# EAGLE design shades_v30 (EAGLE 9.6.2)
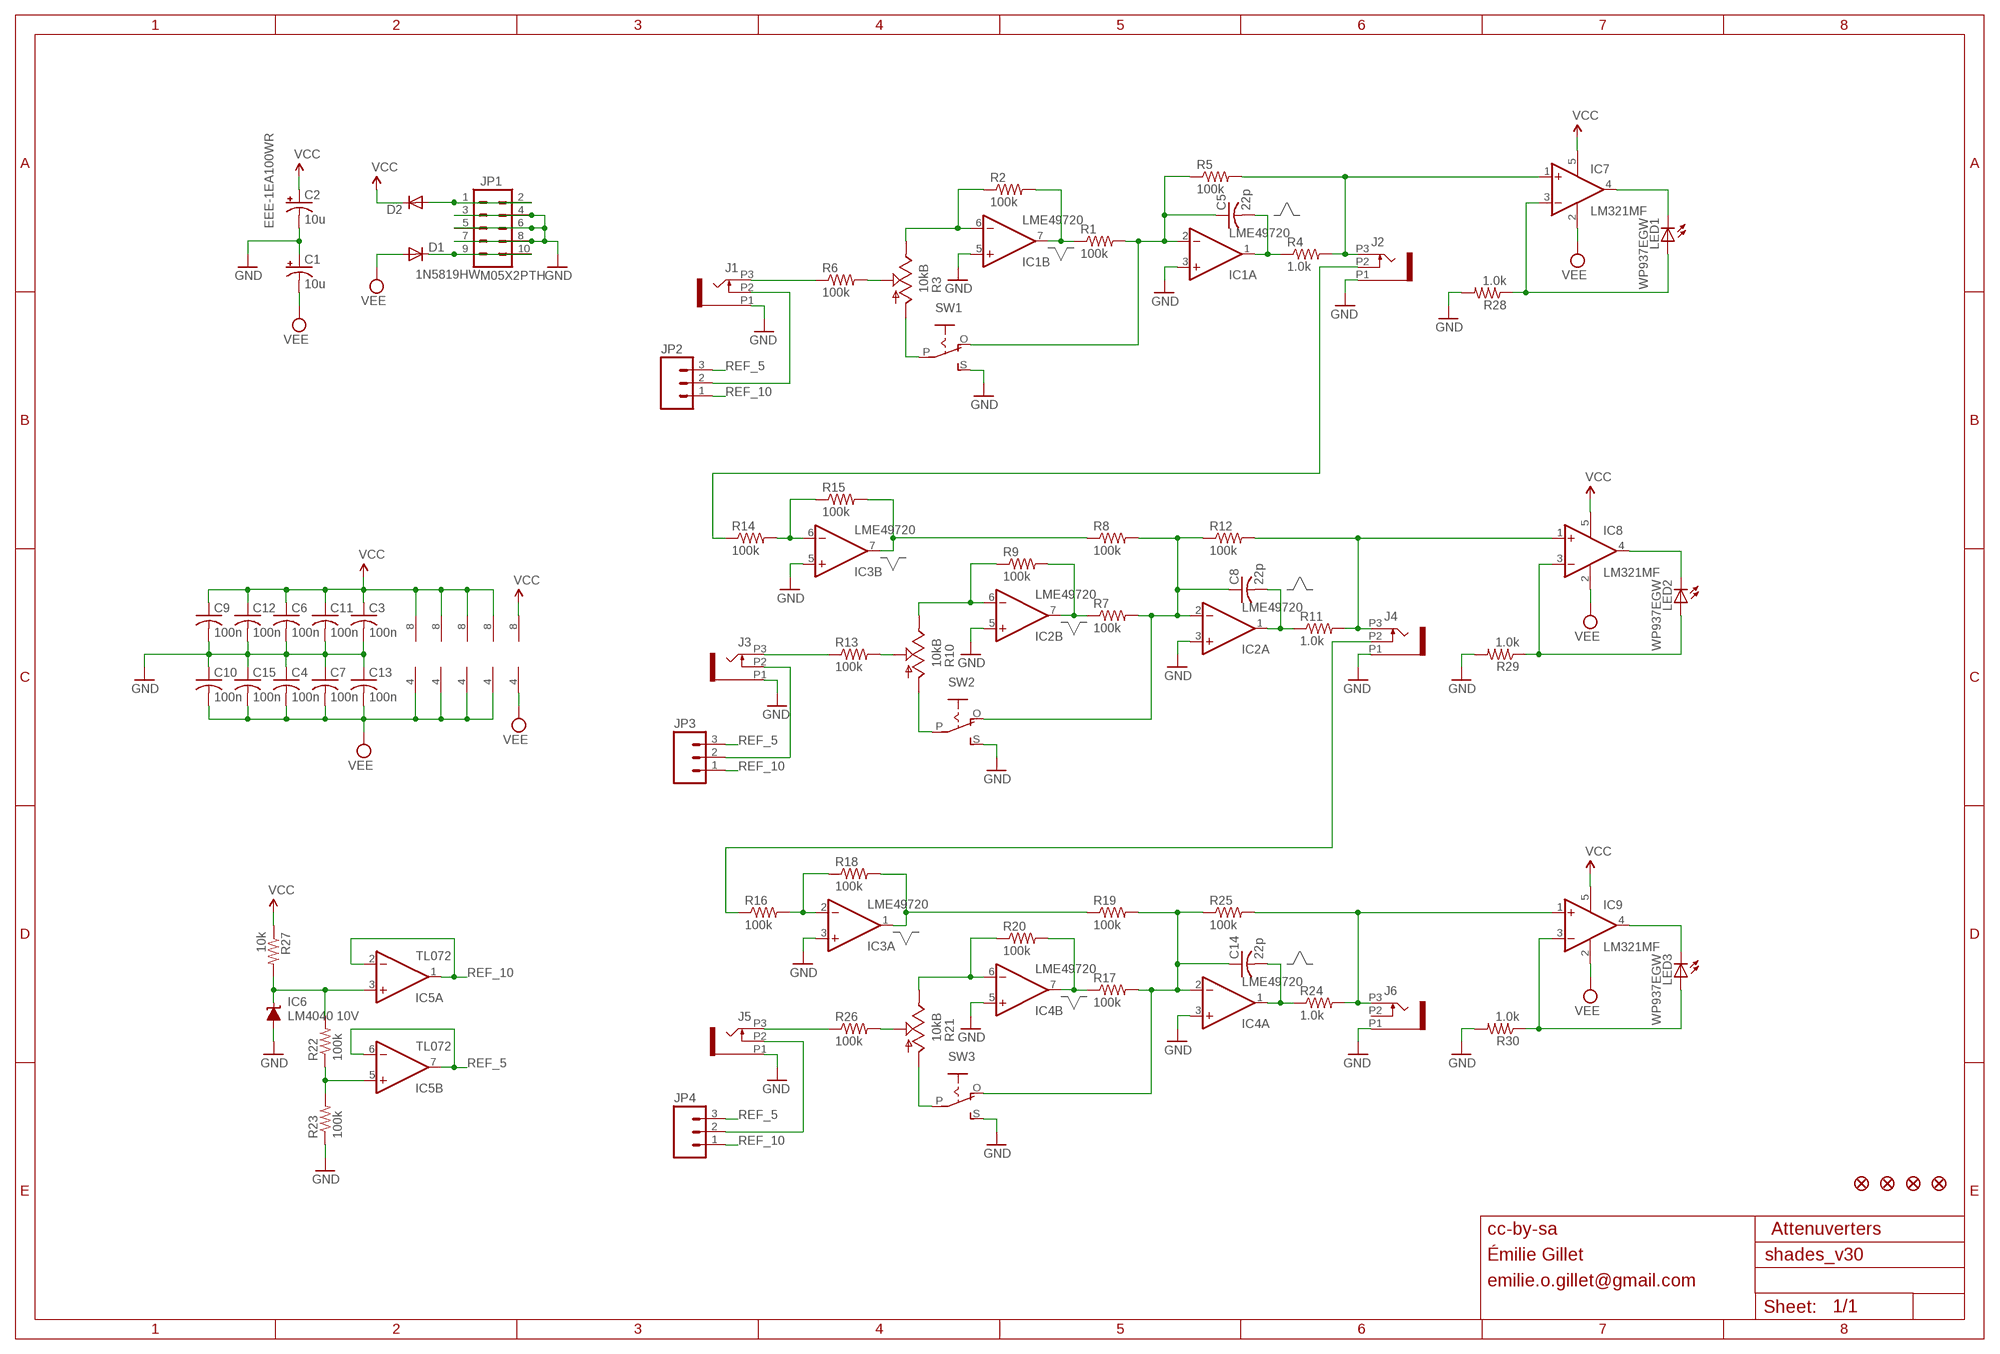
[diagram p0: schematic, sheet 1]

## Parts
C1  10u  CPOL-USB  [PANASONIC_B]
C2  10u  CPOL-USB  [PANASONIC_B]
C3  100n  C-USC0603  [C0603]
C4  100n  C-USC0603  [C0603]
C5  22p  C-USC0603  [C0603]
C6  100n  C-USC0603  [C0603]
C7  100n  C-USC0603  [C0603]
C8  22p  C-USC0603  [C0603]
C9  100n  C-USC0603  [C0603]
C10  100n  C-USC0603  [C0603]
C11  100n  C-USC0603  [C0603]
C12  100n  C-USC0603  [C0603]
C13  100n  C-USC0603  [C0603]
C14  22p  C-USC0603  [C0603]
C15  100n  C-USC0603  [C0603]
D1  1N5819HW  DIODE-SOD123  [SOD123]
D2  1N5819HW  DIODE-SOD123  [SOD123]
F1  FIDUCIAL1X2  [FIDUCIAL-1X2]
F2  FIDUCIAL1X2  [FIDUCIAL-1X2]
F3  FIDUCIAL1X2  [FIDUCIAL-1X2]
F4  FIDUCIAL1X2  [FIDUCIAL-1X2]
IC1  LME49720  TL072D  [SO08]
IC2  LME49720  TL072D  [SO08]
IC3  LME49720  TL072D  [SO08]
IC4  LME49720  TL072D  [SO08]
IC5  TL072  TL072D  [SO08]
IC6  LM4040 10V  LM4041C12DBZ  [DBZ_R-PDSO-G3]
IC7  LM321MF  [SOT23-5]
IC8  LM321MF  [SOT23-5]
IC9  LM321MF  [SOT23-5]
J1  PJ301_THONKICONN6  [WQP_PJ_301M6]
J2  PJ301_THONKICONN6  [WQP_PJ_301M6]
J3  PJ301_THONKICONN6  [WQP_PJ_301M6]
J4  PJ301_THONKICONN6  [WQP_PJ_301M6]
J5  PJ301_THONKICONN6  [WQP_PJ_301M6]
J6  PJ301_THONKICONN6  [WQP_PJ_301M6]
JP1  M05X2PTH  [AVR_ICSP]
JP2  M03PTH  [1X03]
JP3  M03PTH  [1X03]
JP4  M03PTH  [1X03]
LED1  WP937EGW  LED3MM  [LED3MM]
LED2  WP937EGW  LED3MM  [LED3MM]
LED3  WP937EGW  LED3MM  [LED3MM]
R1  100k  R-US_R0603  [R0603]
R2  100k  R-US_R0603  [R0603]
R3  10kB  POT_USVERTICAL_PS  [ALPS_POT_VERTICAL_PS]
R4  1.0k  R-US_R0603  [R0603]
R5  100k  R-US_R0603  [R0603]
R6  100k  R-US_R0603  [R0603]
R7  100k  R-US_R0603  [R0603]
R8  100k  R-US_R0603  [R0603]
R9  100k  R-US_R0603  [R0603]
R10  10kB  POT_USVERTICAL_PS  [ALPS_POT_VERTICAL_PS]
R11  1.0k  R-US_R0603  [R0603]
R12  100k  R-US_R0603  [R0603]
R13  100k  R-US_R0603  [R0603]
R14  100k  R-US_R0603  [R0603]
R15  100k  R-US_R0603  [R0603]
R16  100k  R-US_R0603  [R0603]
R17  100k  R-US_R0603  [R0603]
R18  100k  R-US_R0603  [R0603]
R19  100k  R-US_R0603  [R0603]
R20  100k  R-US_R0603  [R0603]
R21  10kB  POT_USVERTICAL_PS  [ALPS_POT_VERTICAL_PS]
R22  100k  R-US_R0603  [R0603]
R23  100k  R-US_R0603  [R0603]
R24  1.0k  R-US_R0603  [R0603]
R25  100k  R-US_R0603  [R0603]
R26  100k  R-US_R0603  [R0603]
R27  10k  R-US_R0603  [R0603]
R28  1.0k  R-US_R0603  [R0603]
R29  1.0k  R-US_R0603  [R0603]
R30  1.0k  R-US_R0603  [R0603]
SW1  S-ON-ONSMALL_SLIDE  [ES_100SP1T6B11M2QEH_SMALL]
SW2  S-ON-ONSMALL_SLIDE  [ES_100SP1T6B11M2QEH_SMALL]
SW3  S-ON-ONSMALL_SLIDE  [ES_100SP1T6B11M2QEH_SMALL]

## Nets
GND: C1.+ C2.- C3.2 C4.1 C6.2 C7.1 C9.2 C10.1 C11.2 C12.2 C13.1 C15.1 IC1.3(A:+IN) IC1.5(B:+IN) IC2.3(A:+IN) IC2.5(B:+IN) IC3.3(A:+IN) IC3.5(B:+IN) IC4.3(A:+IN) IC4.5(B:+IN) IC6.2(A) J1.P1 J2.P1 J3.P1 J4.P1 J5.P1 J6.P1 JP1.3 JP1.4 JP1.5 JP1.6 JP1.7 JP1.8 R23.1 R28.2 R29.2 R30.2 SW1.S SW2.S SW3.S
N$1: J1.P2 JP2.2
N$2: J3.P2 JP3.2
N$3: J5.P2 JP4.2
N$4: IC7.3(-IN) LED1.A R28.1
N$5: IC5.5(B:+IN) R22.1 R23.2
N$6: D2.A JP1.1 JP1.2
N$7: IC7.4(OUT) LED1.K(C)
N$9: J1.P3 R6.1
N$10: R3.P$2(S) R6.2
N$11: R3.P$3(A) SW1.P
N$12: C5.1 IC1.2(A:-IN) R1.2 R5.1 SW1.O
N$13: IC1.6(B:-IN) R2.1 R3.P$1(E)
N$14: IC1.7(B:OUT) R1.1 R2.2
N$15: C5.2 IC1.1(A:OUT) R4.1
N$16: J3.P3 R13.1
N$17: IC8.3(-IN) LED2.A R29.1
N$18: R10.P$2(S) R13.2
N$19: R10.P$3(A) SW2.P
N$20: D1.C JP1.9 JP1.10
N$22: IC2.6(B:-IN) R9.1 R10.P$1(E)
N$23: IC2.7(B:OUT) R7.1 R9.2
N$24: IC8.4(OUT) LED2.K(C)
N$25: C8.2 IC2.1(A:OUT) R11.1
N$26: J5.P3 R26.1
N$27: R21.P$2(S) R26.2
N$30: IC4.6(B:-IN) R20.1 R21.P$1(E)
N$31: IC4.7(B:OUT) R17.1 R20.2
N$33: C14.2 IC4.1(A:OUT) R24.1
N$34: IC9.3(-IN) LED3.A R30.1
N$35: IC9.4(OUT) LED3.K(C)
N$36: IC3.6(B:-IN) R14.2 R15.1
N$37: IC3.2(A:-IN) R16.2 R18.1
N$38: IC3.1(A:OUT) R18.2 R19.1
N$39: IC3.7(B:OUT) R8.1 R15.2
N$40: C14.1 IC4.2(A:-IN) R17.2 R19.2 R25.1 SW3.O
N$41: C8.1 IC2.2(A:-IN) R7.2 R8.2 R12.1 SW2.O
OUT_1: IC7.1(+IN) J2.P3 R4.2 R5.2
OUT_2: IC8.1(+IN) J4.P3 R11.2 R12.2
OUT_3: IC9.1(+IN) J6.P3 R24.2 R25.2
REF_5: IC5.6(B:-IN) IC5.7(B:OUT) JP2.3 JP3.3 JP4.3
REF_10: IC5.1(A:OUT) IC5.2(A:-IN) JP2.1 JP3.1 JP4.1
REF_10_UNBUF: IC5.3(A:+IN) IC6.1(C) R22.2 R27.2
SEND_1: J2.P2 R14.1
SEND_2: J4.P2 R16.1
SW3: R21.P$3(A) SW3.P
VCC: C2.+ C3.1 C6.1 C9.1 C11.1 C12.1 D2.C IC1.8(P:V+) IC2.8(P:V+) IC3.8(P:V+) IC4.8(P:V+) IC5.8(P:V+) IC7.5(V+) IC8.5(V+) IC9.5(V+) R27.1
VEE: C1.- C4.2 C7.2 C10.2 C13.2 C15.2 D1.A IC1.4(P:V-) IC2.4(P:V-) IC3.4(P:V-) IC4.4(P:V-) IC5.4(P:V-) IC7.2(V-) IC8.2(V-) IC9.2(V-)
Unconnected: J6.P2

## Notes on the sheet
- EEE-1EA100WR
- cc-by-sa | Attenuverters
- Émilie Gillet
- emilie.o.gillet@gmail.com

## Library data of the parts
C1 C2 = rcl:CPOL-US: POLARIZED CAPACITOR, American symbol
C3-C15 = rcl:C-US: CAPACITOR, American symbol
D1 D2 = diode:DIODE-: DIODE
F1-F4 = SparkFun:FIDUCIAL: Fiducial Alignment Points Various fiducial points for machine vision alignment.
IC1-IC5 = gm-ics:TL072: OP AMP
IC6 = texas:LM4041: PRECISION MICROPOWER SHUNT VOLTAGE REFERENCE Source: http://focus.ti.com/lit/ds/slcs146e/slcs146e.pdf
IC7-IC9 = linear:LM321?*: Low Power Single Op Amp Source: http://cache.national.com/ds/LM/LM321.pdf
J1-J6 = og-pj301:PJ301_THONKICONN
JP1 = og-header:M05X2: Header 5x2 Standard 10-pin dual row 0.1" header. Commonly used with AVR-ISP. Use with Spark Fun Electronics SKU: PRT-00778
JP2-JP4 = SparkFun:M03: Header 3 Standard 3-pin 0.1" header. Use with straight break away headers (SKU : PRT-00116), right angle break away headers (PRT-00553), swiss pins (PRT-00743), machine pins (PRT-00117), and female headers (PRT-00115). Molex polarized connector foot print use with SKU : PRT-08232 with associated crimp pins and housings.
LED1-LED3 = led:LED: LED OSRAM: - CHIPLED LG R971, LG N971, LY N971, LG Q971, LY Q971, LO R971, LY R971 LH N974, LH R974 LS Q976, LO Q976, LY Q976 LO Q996 - Hyper CHIPLED LW Q18S LB Q993, LB Q99A, LB R99A - SideLED LS A670, LO A670, LY A670, LG A670, LP A670 LB A673, LV A673, LT A673, LW A673 LH A674 LY A675 LS A676, LA A676, LO A676, LY A676, LW A676 LS A679, LY A679, LG A679 - Hyper Micro SIDELED® LS Y876, LA Y876, LO Y876, LY Y876 LT Y87S - SmartLED LW L88C, LW L88S LB L89C, LB L89S, LG L890 LS L89K, LO L89K, LY L89K LS L896, LA L896, LO L896, LY L896 - TOPLED LS T670, LO T670, LY T670, LG T670, LP T670 LSG T670, LSP T670, LSY T670, LOP T670, LYG T670 LG T671, LOG T671, LSG T671 LB T673, LV T673, LT T673, LW T673 LH T674 LS T676, LA T676, LO T676, LY T676, LB T676, LH T676, LSB T676, LW T676 LB T67C, LV T67C, LT T67C, LS T67K, LO T67K, LY T67K, LW E67C LS E67B, LA E67B, LO E67B, LY E67B, LB E67C, LV E67C, LT E67C LW T67C LS T679, LY T679, LG T679 LS T770, LO T770, LY T770, LG T770, LP T770 LB T773, LV T773, LT T773, LW T773 LH T774 LS E675, LA E675, LY E675, LS T675 LS T776, LA T776, LO T776, LY T776, LB T776 LHGB T686 LT T68C, LB T68C - Hyper Mini TOPLED® LB M676 - Mini TOPLED Santana® LG M470 LS M47K, LO M47K, LY M47K Source: http://www.osram.convergy.de LUXEON: - LUMILED® LXK2-PW12-R00, LXK2-PW12-S00, LXK2-PW14-U00, LXK2-PW14-V00 LXK2-PM12-R00, LXK2-PM12-S00, LXK2-PM14-U00 LXK2-PE12-Q00, LXK2-PE12-R00, LXK2-PE12-S00, LXK2-PE14-T00, LXK2-PE14-U00 LXK2-PB12-K00, LXK2-PB12-L00, LXK2-PB12-M00, LXK2-PB14-N00, LXK2-PB14-P00, LXK2-PB14-Q00 LXK2-PR12-L00, LXK2-PR12-M00, LXK2-PR14-Q00, LXK2-PR14-R00 LXK2-PD12-Q00, LXK2-PD12-R00, LXK2-PD12-S00 LXK2-PH12-R00, LXK2-PH12-S00 LXK2-PL12-P00, LXK2-PL12-Q00, LXK2-PL12-R00 Source: www.luxeon.com KINGBRIGHT: KA-3528ASYC Source: www.kingbright.com
R1 R2 R4-R9 R11-R20 R22-R26 R28-R30 = rcl:R-US_: RESISTOR, American symbol
R3 R10 R21 = pot-alps:POT_US
R27 = resistor:R-US_: RESISTOR, American symbol
SW1-SW3 = og-switch:S-ON-ON: On-on Switch

## Board
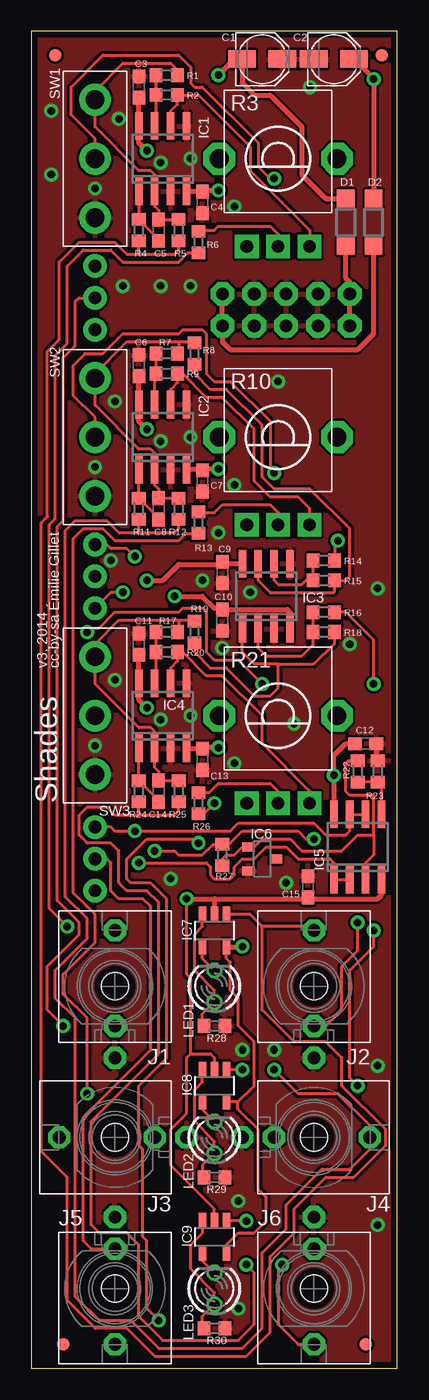
[diagram p1: board, top side]
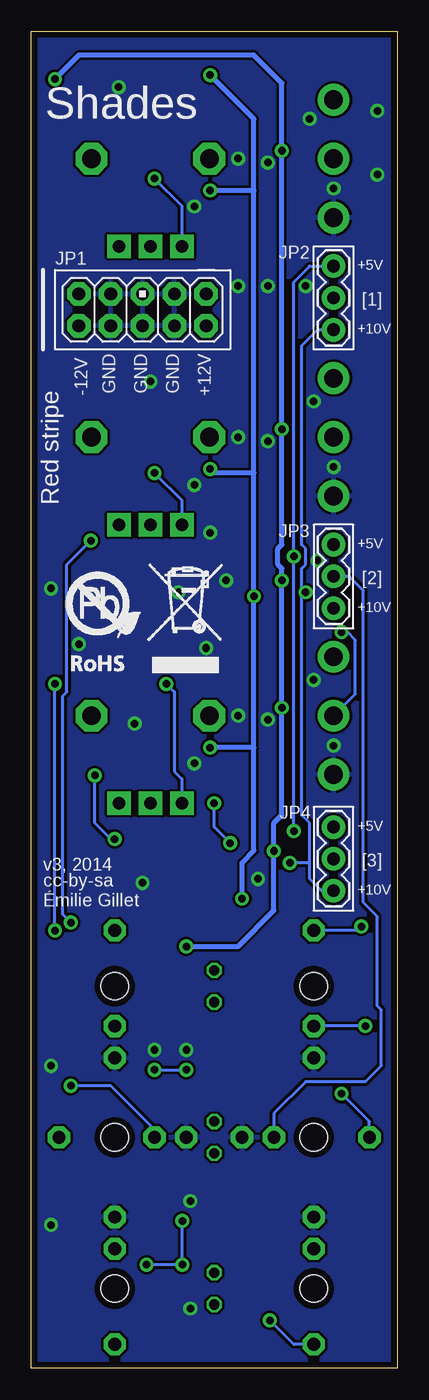
[diagram p2: board, bottom side, seen from below]

Size 29.19 x 106.68 mm. Coordinates in mm from the lower left corner, seen from the top.
Outline: 0,0 29.19,0 29.19,106.68 0,106.68 0,0
Copper layers (1*16): Top 0.035mm / dielectric 1.5mm / Bottom 0.035mm
Design rules "PCBCart-Standard": minimum track width 8mil, minimum drill 0.4mm, track to track 8mil, track to pad 8mil, pad to pad 8mil, via to via 8mil, smd to smd 8mil, copper to edge 20mil, drill to drill 8mil, minimum pad ring 8mil, minimum via ring 10mil, stop-mask expansion 3mil, vias tented up to drill 25mil, thermal gap 8mil

### Footprints (pad centres in the part's own frame; a part is rotated, then mirrored left to right if it is on the bottom)
PANASONIC_B = smd 2.2 x 1.4: + 1.6,0; - -1.6,0
C0603 = smd 1.1 x 1: 1 -0.85,0; 2 0.85,0
SOD123 = smd 1.4 x 1.4: A 1.9,0; C -1.9,0
FIDUCIAL-1X2 = smd 1 x 1: 1 0,0
SO08 = smd 0.6 x 2.2: 1 -1.905,-2.6; 2 -0.635,-2.6; 3 0.635,-2.6; 4 1.905,-2.6; 5 1.905,2.6; 6 0.635,2.6; 7 -0.635,2.6; 8 -1.905,2.6
DBZ_R-PDSO-G3 = smd 0.7 x 1: 1 -0.95,-1.1; 2 0.95,-1.1; 3 0,1.1
SOT23-5 = smd 0.6 x 1.2: 1 -0.95,-1.306; 2 0,-1.306; 3 0.95,-1.306; 4 0.95,1.306; 5 -0.95,1.306
WQP_PJ_301M6 = drill 1.016 pad 1.778 octagon: P1 0,-5.715; P2 0,-3.175; P3 0,4.445 | hole 2.2: 0,0
AVR_ICSP = drill 1.016 pad 1.88 octagon: 1 -1.27,5.08; 2 1.27,5.08; 3 -1.27,2.54; 4 1.27,2.54; 5 -1.27,0; 6 1.27,0; 7 -1.27,-2.54; 8 1.27,-2.54; 9 -1.27,-5.08; 10 1.27,-5.08
1X03 = drill 1.016 pad 1.88: 1 0,0; 2 2.54,0; 3 5.08,0
LED3MM = drill 0.813 octagon: A -1.27,0; K 1.27,0
R0603 = smd 1 x 1.1: 1 -0.85,0; 2 0.85,0
ALPS_POT_VERTICAL_PS = drill 1 pad 1.88 square: P$1 -2.5,7; P$2 0,7; P$3 2.5,7 | drill 1.5 pad 2.54 octagon: P$4 -4.7,0; P$5 4.7,0
ES_100SP1T6B11M2QEH_SMALL = drill 1.5 pad 2.54: O -4.699,0; P 0,0; S 4.699,0

### Placement (x,y rotation side)
C1  18.41,104.46 0 top
C2  24.13,104.46 0 top
C3  8.57,102.24 90 top
C4  13.65,93.03 90 top
C5  10.16,90.81 270 top
C6  8.57,80.01 90 top
C7  13.65,70.8 90 top
C8  10.16,68.58 270 top
C9  15.24,63.5 270 top
C10  15.24,59.69 90 top
C11  8.57,57.78 90 top
C12  26.67,49.85 0 top
C13  13.65,48.58 90 top
C14  10.16,46.04 270 top
C15  22.07,38.42 270 top
D1  25.08,91.44 90 top
D2  27.31,91.44 270 top
F1  1.91,104.78 90 top
F2  27.94,104.78 90 top
F3  2.54,1.91 90 top
F4  26.67,1.91 90 top
IC1  10.48,96.52 0 top
IC2  10.48,74.3 0 top
IC3  18.73,61.59 0 top
IC4  10.48,52.07 0 top
IC5  26.04,41.59 0 top
IC6  18.41,40.64 270 top
IC7  14.61,34.92 180 top
IC8  14.61,22.54 180 top
IC9  14.61,10.48 180 top
J1  6.67,30.48 0 top
J2  22.54,30.48 0 top
J3  6.67,18.41 90 top
J4  22.54,18.41 270 top
J5  6.67,6.35 180 top
J6  22.54,6.35 180 top
JP1  20.32,84.45 270 bottom
JP2  5.08,82.87 90 bottom
JP3  5.08,60.64 90 bottom
JP4  5.08,38.1 90 bottom
LED1  14.61,30.48 90 top
LED2  14.61,18.41 90 top
LED3  14.61,6.35 90 top
R1  10.79,103.19 0 top
R2  10.79,101.6 180 top
R3  19.68,96.52 180 top
R4  8.57,90.81 270 top
R5  11.75,90.81 270 top
R6  13.34,89.85 90 top
R7  10.79,80.96 0 top
R8  13.02,80.96 90 top
R9  10.79,79.38 180 top
R10  19.68,74.3 180 top
R11  8.57,68.58 270 top
R12  11.75,68.58 270 top
R13  13.33,67.47 90 top
R14  23.34,64.45 180 top
R15  23.34,62.87 0 top
R16  23.34,60.33 180 top
R17  10.79,58.74 0 top
R18  23.34,58.74 0 top
R19  13.02,58.74 90 top
R20  10.8,57.15 180 top
R21  19.68,52.07 180 top
R22  26.04,47.62 90 top
R23  27.62,47.62 270 top
R24  8.57,46.04 270 top
R25  11.75,46.04 270 top
R26  13.34,45.09 90 top
R27  15.24,40.96 270 top
R28  14.61,27.3 0 top
R29  14.61,15.24 0 top
R30  14.61,3.17 0 top
SW1  5.08,96.52 270 top
SW2  5.08,74.3 270 top
SW3  5.08,52.07 270 top
U$2  [ROHS]  27.3,54.93 0 bottom

### Tracks (layer width: path | path; a pad name or v marks a point on that pad's centre or on a via)
GND  (via drill 0.6)
  Top 0.254: 27.52,48.58 R23.1
  Top 0.406: C12.2 27.52,48.58
  other vias: 16.51,13.34 16.83,25.4 12.7,96.52 5.08,94.14 5.08,71.91 12.7,74.3 16.19,92.71 16.19,70.48 5.08,49.69 12.7,52.07 16.19,48.26 27.62,62.23 13.65,62.87 15.24,57.47 22.23,102.23 7.3,86.36 12.7,86.36 6.99,99.69 6.67,77.15 6.67,54.93 20.32,38.73 25.4,57.78 20.95,51.44 17.46,61.91 6.35,64.45 14.92,66.67 1.59,100.33 1.59,95.25 27.62,11.43 27.62,24.13 19.37,25.4 19.68,78.74 10.32,73.98 10.32,51.75 11.11,39.05 10.32,86.36 10.32,96.2 16.51,4.76
  pour Bottom: 0,106.68 0,0 29.21,0 29.21,106.68
  pour Top: 0,106.68 0,0 29.21,0 29.21,106.68
N$1  (via drill 0.6)
  Top 0.254: JP2.2 3.81,85.41 3.49,85.09 3.49,81.6 2.54,80.64 2.54,67.63 2.06,67.15 2.06,37.31 3.81,35.56 3.81,34.61 1.27,32.07 1.27,28.57 v2.54,27.3
  Bottom 0.254: v2.54,27.3 J1.P2
N$2
  Bottom 0.254: JP3.2 3.81,63.18 2.7,62.07 2.7,37.15 1.59,36.04 1.59,28.89 1.27,28.57 1.27,24.13 2.54,22.86 7.3,22.86 9.84,20.32 J3.P2
N$3
  Top 0.254: JP4.2 6.03,40.64 6.35,40.32 6.35,38.1 6.99,37.47 8.89,37.47 9.53,36.83 9.53,25.4 4.13,20 4.13,10.16 4.76,9.53 J5.P2
N$4
  Top 0.254: R28.1 13.65,27.41 13.65,28.26 LED1.A 14.61,30.16 13.02,31.75 13.02,34.61 13.65,35.24 IC7.3
N$5
  Top 0.254: R22.1 R23.2 27.62,46.67 27.94,46.35 IC5.5
N$6
  Top 0.406: D2.A | D2.A 27.3,82.55 26.04,81.28 15.88,81.28 15.24,81.92 JP1.2 JP1.1
N$7
  Top 0.254: IC7.4 13.65,32.7 LED1.K
N$9  (via drill 0.6)
  Top 0.254: v2.86,35.24 1.43,36.67 1.43,67.31 1.91,67.79 1.91,80.8 2.86,81.76 2.86,87.95 4.13,89.22 6.35,89.22 7.3,88.27 11.75,88.27 12.48,89 R6.1
  Bottom 0.254: v2.86,35.24 2.9,35.28 3.25,34.92 J1.P3
N$10
  Top 0.254: R6.2 13.44,90.81 14.61,90.81 14.92,91.12 19.05,91.12 19.68,90.49 R3.P$2
N$11  (via drill 0.6)
  Top 0.254: v19.37,94.93 19.05,94.93 18.1,95.89 18.1,97.79 13.65,102.23 13.02,102.23 12.7,102.55 12.7,103.82 11.75,104.78 5.71,104.78 3.17,102.23 3.17,100.01 5.08,98.11 SW1.P
  Bottom 0.254: v19.37,94.93 17.18,92.75 R3.P$3
N$12
  Top 0.254: R5.1 C5.1 10.16,92.39 9.84,92.71 IC1.2 9.84,95.25 9.53,95.57 8.57,95.57 5.08,99.06 SW1.O 5.08,101.92 7.3,104.14 11.11,104.14 11.64,103.61 R1.2
N$13
  Top 0.254: IC1.6 11.11,100.33 11.64,100.86 R2.1 13.34,101.6 17.46,97.47 17.46,95.57 22.23,90.81 22.23,89.56 R3.P$1
N$14
  Top 0.254: IC1.7 9.95,99.22 R2.2 | R2.2 | R2.2 R1.1
N$15
  Top 0.254: IC1.1 R4.1 10.16,90.07 C5.2
N$16  (via drill 0.6)
  Top 0.254: 4.45,36.83 3.33,37.94 3.33,66.2 4.13,66.99 5.71,66.99 6.67,66.04 11.75,66.04 12.33,66.62 R13.1 | 4.45,36.83 | 4.45,36.83 5.08,36.2 5.08,33.97 2.54,31.43 2.54,29.84 4.45,27.94 v4.45,21.91
  Bottom 0.254: v4.45,21.91 2.22,19.68 J3.P3
N$17
  Top 0.254: R29.1 13.65,15.34 13.65,16.19 LED2.A 14.61,18.1 13.02,19.68 13.02,22.23 13.65,22.86 IC8.3
N$18
  Top 0.254: R13.2 13.39,68.26 14.61,68.26 15.24,68.9 19.05,68.9 19.68,68.26 R10.P$2
N$19  (via drill 0.6)
  Top 0.254: v19.37,71.44 19.05,71.75 19.05,75.56 15.88,78.74 14.61,78.74 13.97,79.38 13.97,82.55 13.65,82.87 12.06,82.87 11.75,82.55 7.3,82.55 5.71,80.96 4.29,80.96 3.33,80.01 3.33,77.63 5.08,75.88 SW2.P
  Bottom 0.254: v19.37,71.44 17.18,69.25 R10.P$3
N$20
  Top 0.406: JP1.10 JP1.9 25.4,86.68 25.08,87 D1.C
N$22
  Top 0.254: R10.P$1 22.23,67.33 22.23,68.58 21.27,69.53 19.05,69.53 17.78,70.8 17.78,74.93 15.24,77.47 13.97,77.47 12.06,79.38 R9.1 11.64,78.64 11.11,78.11 IC2.6
N$23
  Top 0.254: IC2.7 9.84,78.74 9.95,78.84 R9.2 R7.1
N$24
  Top 0.254: IC8.4 13.65,20.64 LED2.K
N$25
  Top 0.254: IC2.1 R11.1 10.16,67.84 C8.2
N$26  (via drill 0.6)
  Top 0.254: v13.34,41.91 13.02,42.23 9.21,42.23 7.62,40.64 7.62,39.05 7.94,38.73 9.53,38.73 10.79,37.47 10.79,24.77 8.57,22.54 8.57,17.78 8.89,17.46 8.89,10.48 9.21,10.16 9.21,4.76 v10.16,3.81 | v14.61,45.09 13.76,44.23 R26.1
  Bottom 0.254: v13.34,41.91 14.61,43.18 v14.61,45.09 | v10.16,3.81 8.26,1.91 J5.P3
N$27
  Top 0.254: R21.P$2 19.68,46.04 19.05,46.67 14.92,46.67 14.19,45.94 R26.2
N$30
  Top 0.254: IC4.6 | IC4.6 11.11,55.88 11.64,56.41 R20.1 12.06,57.15 13.97,55.24 15.24,55.24 18.41,52.07 18.41,49.85 22.23,46.04 22.23,45.11 R21.P$1
N$31
  Top 0.254: IC4.7 9.95,54.77 R20.2 | R20.2 | R20.2 R17.1
N$33
  Top 0.254: IC4.1 R24.1 10.16,45.3 C14.2
N$34
  Top 0.254: R30.1 13.65,3.28 13.65,4.13 LED3.A 14.61,6.03 12.7,7.94 12.7,9.84 13.65,10.8 IC9.3
N$35
  Top 0.254: IC9.4 13.65,8.57 LED3.K
N$36
  Top 0.254: IC3.6 19.37,62.87 19.68,62.55 21.59,62.55 21.91,62.87 R15.1 R14.2
N$37
  Top 0.254: IC3.2 18.1,57.47 18.73,56.83 21.59,56.83 22.49,57.73 R18.1 R16.2
N$38
  Top 0.254: R19.1 13.02,57.15 14.29,55.88 15.56,55.88 17.78,53.66 19.05,53.66 19.68,54.29 19.68,56.2 | IC3.1 16.83,57.15 17.78,56.2 19.68,56.2 | 19.68,56.2 22.54,56.2 24.19,57.84 R18.2
N$39
  Top 0.254: R8.1 13.02,79.38 14.29,78.11 15.56,78.11 18.41,75.25 18.41,71.12 19.37,70.17 22.23,70.17 25.4,66.99 25.4,63.18 25.08,62.87 R15.2 24.19,61.97 24.13,61.91 19.05,61.91 18.1,62.87 IC3.7
N$40
  Top 0.254: C14.1 | C14.1 10.16,47.62 9.84,47.94 IC4.2 9.84,50.8 | C14.1 R25.1 | R19.2 12.91,59.69 11.75,59.69 | 11.75,59.69 6.99,59.69 5.08,57.78 SW3.O 5.08,54.61 8.57,51.12 9.53,51.12 9.84,50.8 | R17.2 11.75,58.84 11.75,59.69 | 9.84,50.8
N$41
  Top 0.254: R12.1 C8.1 10.16,70.17 9.84,70.48 IC2.2 9.84,73.03 9.53,73.34 8.57,73.34 5.08,76.83 SW2.O 5.08,79.38 7.62,81.92 11.75,81.92 | R7.2 11.75,81.06 11.75,81.92 | R8.2 12.91,81.92 11.75,81.92
OUT_1
  Top 0.254: IC7.1 15.59,36.2 17.46,36.2 18.38,35.28 18.41,35.28 | R5.2 11.75,89.22 11.43,88.9 8.57,88.9 | 8.57,88.9 7.62,88.9 6.67,89.85 3.81,89.85 2.22,88.27 2.22,82.07 1.27,81.12 1.27,67.94 0.79,67.47 0.79,17.3 2.86,15.24 2.86,5.4 5.08,3.17 7.62,3.17 9.84,0.95 17.14,0.95 19.05,2.86 19.05,8.89 20.95,10.79 20.95,12.7 23.5,15.24 25.72,15.24 28.26,17.78 28.26,19.05 24.77,22.54 24.77,24.77 23.5,26.04 20.95,26.04 18.41,28.57 18.41,35.28 | 8.57,88.9 R4.2 | J2.P3 22.19,35.28 18.41,35.28
OUT_2  (via drill 0.6)
  Top 0.254: IC8.1 15.59,23.81 v16.83,23.81 | R12.2 11.75,66.99 11.43,66.67 8.57,66.67 | 8.57,66.67 6.99,66.67 6.03,67.63 3.49,67.63 2.7,66.83 2.7,37.62 4.45,35.88 4.45,34.29 1.91,31.75 1.91,29.53 3.49,27.94 3.49,5.71 5.4,3.81 7.94,3.81 10.16,1.59 16.83,1.59 18.41,3.17 18.41,9.21 20.32,11.11 20.32,13.02 23.18,15.88 25.4,15.88 26.99,17.46 J4.P3 26.99,19.37 24.45,21.91 21.27,21.91 v19.37,23.81 | 8.57,66.67 R11.2
  Bottom 0.254: v19.37,23.81 v16.83,23.81
OUT_3  (via drill 0.6)
  Top 0.254: IC9.1 15.59,11.75 v17.14,11.75 | R25.2 11.75,44.45 11.43,44.13 8.57,44.13 | 8.57,44.13 6.67,44.13 6.03,44.77 4.45,44.77 3.81,44.13 3.81,42.55 4.45,41.91 6.35,41.91 6.99,41.27 6.99,38.73 7.62,38.1 9.21,38.1 10.16,37.15 10.16,25.08 4.76,19.68 4.76,11.43 5.4,10.79 7.62,10.79 8.57,9.84 8.57,4.13 10.48,2.22 16.51,2.22 17.78,3.49 17.78,7.62 v17.14,8.26 | R24.2 8.57,44.13 | v20,8.26 19.68,7.94 19.68,3.49 21.27,1.91 J6.P3
  Bottom 0.254: v17.14,11.75 v17.14,8.26 v20,8.26
REF_5  (via drill 0.6)
  Top 0.254: JP3.3 6.03,65.72 6.35,65.41 7.62,65.41 v8.26,64.77 | JP4.3 6.35,43.18 6.67,42.86 v8.26,42.86 15.88,42.86 16.51,43.5 22.54,43.5 23.5,42.55 25.08,42.55 25.4,42.86 IC5.7 IC5.6
  Bottom 0.254: JP2.3 6.99,87.95 8.26,86.68 v8.26,64.77 v8.26,42.86
REF_10  (via drill 0.6)
  Top 0.254: IC5.2 IC5.1 24.13,40.32 23.81,40.64 21.27,40.64 20.32,41.59 18.73,41.59 17.78,40.64 16.83,40.64 16.19,40.01 16.19,39.37 15.88,39.05 14.61,39.05 14.29,39.37 14.29,40.01 13.97,40.32 v8.57,40.32 | JP3.1 6.35,61.91 v7.3,61.91
  Bottom 0.254: JP2.1 6.35,82.87 7.62,81.6 7.62,65.72 7.3,65.41 7.3,64.14 7.62,63.82 7.62,61.91 | 6.99,40.32 6.99,43.5 7.62,44.13 7.62,61.91 | 6.99,40.32 v8.57,40.32 | 6.99,40.32 6.99,39.05 6.03,38.1 JP4.1 | 7.62,61.91 v7.3,61.91
REF_10_UNBUF
  Top 0.254: IC5.3 26.67,40.32 27.3,40.96 27.3,42.55 | 27.3,42.55 27.3,45.72 25.4,45.72 25.08,46.04 25.08,48.26 25.3,48.48 R22.2 | 27.3,42.55 26.04,42.55 24.77,41.27 21.59,41.27 20.64,42.23 18.41,42.23 17.78,41.59 IC6.1 16.82,41.59 16.19,40.96 15.56,40.96 15.24,40.64 R27.2
SEND_1  (via drill 0.6)
  Top 0.254: 24.13,64.51 R14.1 24.19,65.78 v24.45,66.04 | v26.04,35.56 26.04,33.34 24.77,32.07 24.77,28.57 23.5,27.3 J2.P2
  Bottom 0.254: v24.45,66.04 26.35,64.14 26.35,53.98 26.67,53.66 26.67,36.2 v26.04,35.56
SEND_2  (via drill 0.6)
  Top 0.254: v27.3,34.92 27.3,33.66 25.4,31.75 25.4,23.18 v26.04,22.54 | R16.1 25.08,60.33 27.3,58.1 v27.3,54.61
  Bottom 0.254: v27.3,34.92 v27.3,54.61 | v26.04,22.54 22.86,22.54 19.37,19.05 J4.P2
SW3  (via drill 0.6)
  Top 0.254: v4.45,58.74 4.76,59.05 5.4,59.05 6.67,60.33 11.75,60.33 12.06,60.64 13.65,60.64 13.97,60.33 13.97,57.15 14.61,56.52 16.51,56.52 v18.41,54.61
  Bottom 0.254: v4.45,58.74 3.97,58.74 3.33,58.1 3.33,53.82 SW3.P | R21.P$3 17.18,47.03 17.78,47.62 17.78,53.98 v18.41,54.61
VCC  (via drill 0.6)
  Top 0.254: IC7.5 15.56,32.7 15.88,32.38 15.88,30.16 16.51,29.53 16.51,27.3 17.78,26.04 17.78,22.54 16.47,21.24 | 16.47,21.24 IC8.5 | IC9.5 15.59,9.21 15.56,9.24 15.56,9.84 16.51,10.79 17.78,10.79 18.73,11.75 18.73,13.65 18.1,14.29 18.1,19.05 16.47,20.67 16.47,21.24 | 15.14,64.45 C9.1 | v22.54,42.23 21.91,42.23 21.27,42.86 16.83,42.86 15.88,41.91 15.34,41.91 R27.1 14.5,41.81 13.65,40.96 11.75,40.96 11.43,41.27 v9.84,41.27
  Top 0.406: D2.C | C6.1 IC2.8 8.57,75.56 v9.21,74.93 | v9.21,97.16 8.57,97.79 IC1.8 C3.1 | C11.1 IC4.8 8.57,53.34 v9.21,52.7 | C9.1 15.39,64.19 IC3.8 | 15.14,64.45 14.82,64.14 11.75,64.14 10.48,62.87 v9.21,62.87 | IC5.8 v24.13,47.31 24.13,48.9 25.08,49.85 C12.1 | v16.83,33.66 16.79,33.62 IC7.5 | D2.C v27.3,102.87 27.3,102.88 C2.+
  Bottom 0.254: v22.54,42.23 22.86,42.23 24.13,43.5 v24.13,47.31
  Bottom 0.406: v27.3,102.87 25.4,104.78 11.43,104.78 9.21,102.55 v9.21,97.16 v9.21,74.93 9.21,65.72 9.53,65.41 9.53,64.14 9.21,63.82 v9.21,62.87 v9.21,52.7 9.21,44.13 9.84,43.5 v9.84,41.27 9.84,36.51 12.7,33.66 v16.83,33.66
VEE  (via drill 0.6)
  Top 0.254: IC9.2 14.61,12.7 11.11,16.19 11.11,19.05 12.38,20.32 12.38,24.77 12.7,25.08 | 12.7,25.08 14.29,25.08 14.61,24.77 IC8.2 | v12.38,37.47 12.38,31.43 12.7,31.11 12.7,25.08 | 15.14,60.64 C10.2
  Top 0.406: 25.08,93.66 D1.A 23.5,93.34 21.59,95.25 21.59,99.06 19.05,101.6 17.78,101.6 16.82,102.56 C1.- 16.19,104.46 v14.92,103.19 | IC1.4 12.43,93.88 C4.2 13.76,93.98 v14.92,93.98 | v14.92,71.75 13.76,71.75 C7.2 13.61,71.69 IC2.4 | 12.34,49.43 IC4.4 12.43,49.43 C13.2 13.76,49.53 v14.92,49.53 | 15.14,60.64 14.61,60.64 13.65,61.59 v11.43,61.59 | IC3.4 20.64,60.33 20.42,60.54 C10.2 | IC5.4 27.94,37.78 27.62,37.47 22.23,37.47 22.12,37.57 C15.2 21.96,37.47 14.61,37.47 | v12.38,37.47 14.61,37.47 | 14.61,37.47 IC7.2
  Bottom 0.406: v14.92,93.98 11.43,93.98 | v14.92,71.75 14.61,71.44 11.43,71.44 | 11.43,71.44 11.43,93.98 | 11.43,49.53 v11.43,61.59 11.43,71.44 | 11.43,49.53 v14.92,49.53 | v14.92,103.19 11.43,99.69 11.43,93.98 | v12.38,37.47 12.38,40.32 11.43,41.27 11.43,49.53

### Text on the board
bPlace: +5V | [1] | +10V | Red stripe | +5V | [2] | +10V | +5V | [3] | +10V
tNames: v3, 2014 | cc-by-sa Émilie Gillet | Shades
bNames: Shades | +12V | GND | GND | GND | -12V | v3, 2014 | cc-by-sa | Émilie Gillet
Drill_legend: Drill legend | Date: 03/11/14 17:47 | 2.2000 mm / 86.614 mil | 1.5000 mm / 59.055 mil | 1.0160 mm / 40.000 mil | 1.0000 mm / 39.370 mil | 0.8128 mm / 32.000 mil | 0.6000 mm / 23.622 mil